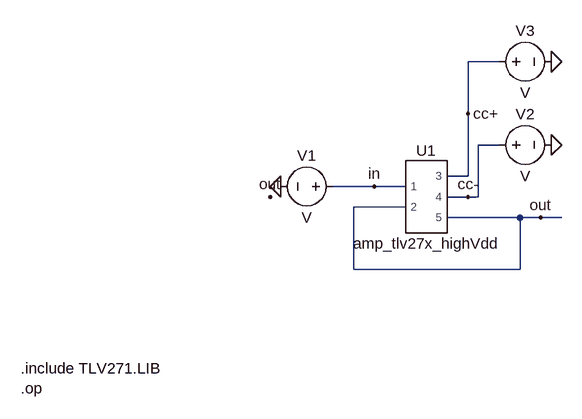
[diagram p0: schematic Exercise4_a.asc]
Exercise4_a.asc, the LTspice schematic file:
Version 4.1
SHEET 1 880 680
WIRE 352 -208 304 -208
WIRE 304 -128 304 -208
WIRE 352 -80 320 -80
WIRE 304 -32 304 -128
WIRE 304 -32 272 -32
WIRE 160 -16 96 -16
WIRE 208 -16 160 -16
WIRE 304 0 272 0
WIRE 320 0 320 -80
WIRE 320 0 304 0
WIRE 208 16 128 16
WIRE 384 32 272 32
WIRE 416 32 384 32
WIRE 448 32 416 32
WIRE 128 112 128 16
WIRE 384 112 384 32
WIRE 384 112 128 112
FLAG 16 -16 0
FLAG 432 -208 0
FLAG 432 -80 0
FLAG 160 -16 in
FLAG 304 -128 cc+
FLAG 304 0 cc-
FLAG 416 32 out
FLAG 0 0 out
SYMBOL amp_tlv27x_highVdd1 240 0 R0
SYMATTR InstName U1
SYMBOL voltage 112 -16 R90
WINDOW 0 -32 56 VBottom 2
WINDOW 3 32 56 VTop 2
SYMATTR InstName V1
SYMBOL voltage 336 -80 R270
WINDOW 0 32 56 VTop 2
WINDOW 3 -32 56 VBottom 2
SYMATTR InstName V2
SYMBOL voltage 336 -208 R270
WINDOW 0 32 56 VTop 2
WINDOW 3 -32 56 VBottom 2
SYMATTR InstName V3
TEXT -384 264 Left 2 !.include TLV271.LIB\n.op

The netlist it stands for:
* Exercise4_a.asc
X§U1 in out cc+ cc- out amp_tlv27x_highVdd  ; pins 1 2 3 4 5
V1 in 0 V
V2 cc- 0 V
V3 cc+ 0 V
.include TLV271.LIB
.op
.lib TLV271.LIB
.backanno
.end